# EAGLE design ERC128128FS_Breakout (EAGLE 7.4.0)
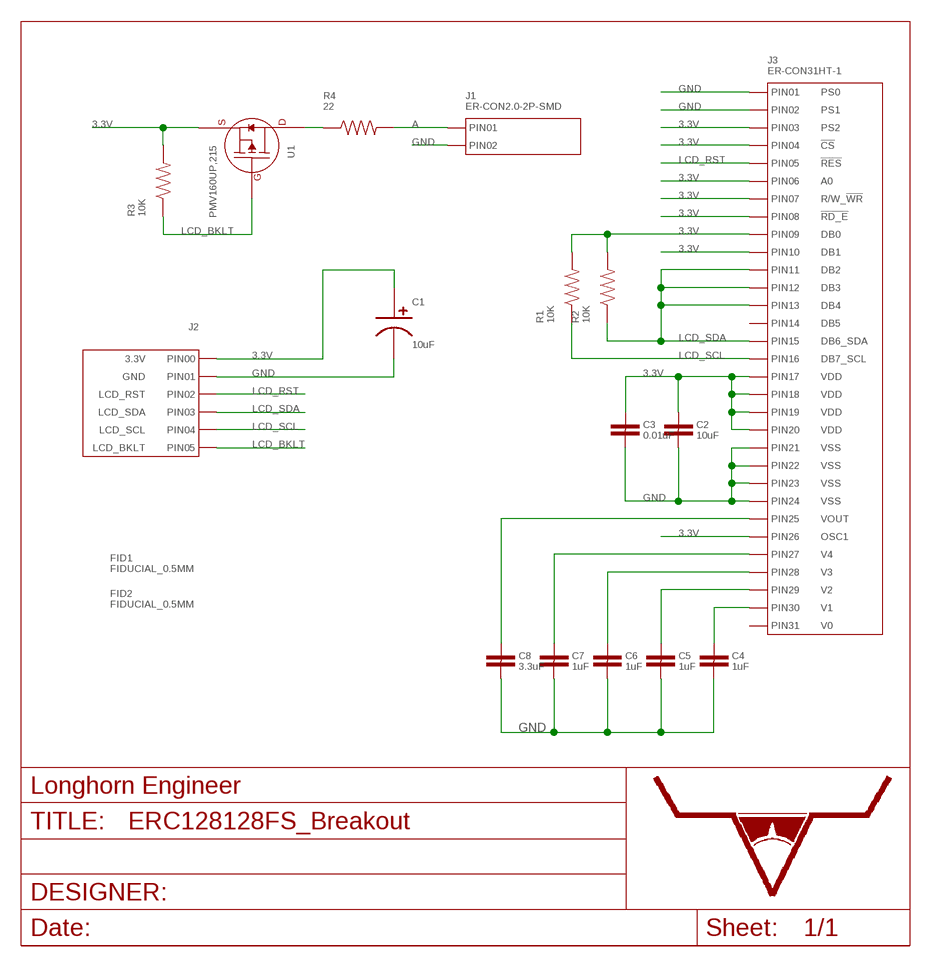
[diagram p0: schematic, sheet 1]

## Parts
C1  10uF  CAPACITOR_P_4MM  [CP4MM]
C2  10uF  CAPACITOR_NON_POLAR_1206  [1206]
C3  0.01uF  CAPACITOR_NON_POLAR_0603  [0603]
C4  1uF  CAPACITOR_NON_POLAR_0603  [0603]
C5  1uF  CAPACITOR_NON_POLAR_0603  [0603]
C6  1uF  CAPACITOR_NON_POLAR_0603  [0603]
C7  1uF  CAPACITOR_NON_POLAR_0603  [0603]
C8  3.3uF  CAPACITOR_NON_POLAR_0603  [0603]
FID1  FIDUCIAL_0.5MM  [FIDUCIAL_0.5MM]
FID2  FIDUCIAL_0.5MM  [FIDUCIAL_0.5MM]
J1  ER-CON2.0-2P-SMD  CON_01X02_ER-CON2.0-2P-SMD  [ER-CON2.0-2P-SMD]
J2  HEADER_01X06_PTH_2.54MM  [PTH_2.54MM_01X06]
J3  ER-CON31HT-1  CON_01X31_ER-CON31HT-1  [ER-CON31HT-1]
R1  10K  RESISTOR_0603  [0603]
R2  10K  RESISTOR_0603  [0603]
R3  10K  RESISTOR_0603  [0603]
R4  22  RESISTOR_0603  [0603]
U1  PMV160UP,215  MOSFET_P-CHANNEL_SINGLE_SOT-23  [SOT-23-3]
U$1  LHE_FRAME  [LHE_FRAME]

## Nets
3.3V: C1.P$1 C2.1 C3.1 J2.P$1(PIN0) J3.P$3(PIN3) J3.P$4(PIN4) J3.P$6(PIN6) J3.P$7(PIN7) J3.P$8(PIN8) J3.P$9(PIN9) J3.P$10(PIN10) J3.P$17(PIN17) J3.P$18(PIN18) J3.P$19(PIN19) J3.P$20(PIN20) J3.P$26(PIN26) R1.2 R2.2 R3.2 U1.2(SOURCE)
A: J1.P$1(PIN1) R4.2
GND: C1.P$2 C2.2 C3.2 C4.2 C5.2 C6.2 C7.2 C8.2 J1.P$2(PIN2) J2.P$2(PIN1) J3.P$1(PIN1) J3.P$2(PIN2) J3.P$21(PIN21) J3.P$22(PIN22) J3.P$23(PIN23) J3.P$24(PIN24)
LCD_BKLT: J2.P$6(PIN5) R3.1 U1.1(GATE)
LCD_RST: J2.P$3(PIN2) J3.P$5(PIN5)
LCD_SCL: J2.P$5(PIN4) J3.P$16(PIN16) R1.1
LCD_SDA: J2.P$4(PIN3) J3.P$11(PIN11) J3.P$12(PIN12) J3.P$13(PIN13) J3.P$15(PIN15) R2.1
N$7: R4.1 U1.3(DRAIN)
N$9: C8.1 J3.P$25(PIN25)
N$10: C7.1 J3.P$27(PIN27)
N$11: C6.1 J3.P$28(PIN28)
N$12: C5.1 J3.P$29(PIN29)
N$13: C4.1 J3.P$30(PIN30)
Unconnected: J3.P$14(PIN14) J3.P$31(PIN31)

## Library data of the parts
C1 = MF_Passives:CAPACITOR_P: Library: MF_Passives Description: Device for Polarized Capacitors. Manufacture part number (MFG#), Voltage Rating, and Tolerance can be added via Attributes.; MFG#: N/A; TOLERANCE: N/A; VOLTAGE: N/A
C2-C8 = PP_Passives:CAPACITOR_NON_POLAR: Capacitor Non Polarized
FID1 FID2 = MF_Aesthetics:FIDUCIAL: Library: MF_Aesthetics Description: Fiducial marking for PCB alignment inside PNP and other machines.
J1 = PP_Connectors:CON_01X02
J2 = MF_Connectors:HEADER_01X06: Library: MF_Connectors Description: Header Connector with 6 Positions and 01 Rows. Use the LABEL Attribute to label the pin on the schematic and PCB. You can remove the attributes on the PCB by using the SMASH function on the part and then deleting the text.; LABEL00: 3.3V; LABEL01: GND; LABEL02: LCD_RST; LABEL03: LCD_SDA; LABEL04: LCD_SCL; LABEL05: LCD_BKLT
J3 = PP_Connectors:CON_01X31; LABEL01: PS0; LABEL02: PS1; LABEL03: PS2; LABEL04: !CS; LABEL05: !RES; LABEL06: A0; LABEL07: R/W_!WR; LABEL08: !RD_E; LABEL09: DB0; LABEL10: DB1; LABEL11: DB2; LABEL12: DB3; LABEL13: DB4; LABEL14: DB5; LABEL15: DB6_SDA; LABEL16: DB7_SCL; LABEL17: VDD; LABEL18: VDD; LABEL19: VDD; LABEL20: VDD; LABEL21: VSS; LABEL22: VSS; LABEL23: VSS; LABEL24: VSS; LABEL25: VOUT; LABEL26: OSC1; LABEL27: V4; LABEL28: V3; LABEL29: V2; LABEL30: V1; LABEL31: V0
R1-R4 = PP_Passives:RESISTOR: Resistors
U1 = PP_DiscreteSemi:MOSFET_P-CHANNEL_SINGLE
U$1 = PP_Aesthetics:LHE_FRAME; DNAME: Parker Dillmann; REVNUM: REV: 2

## Board
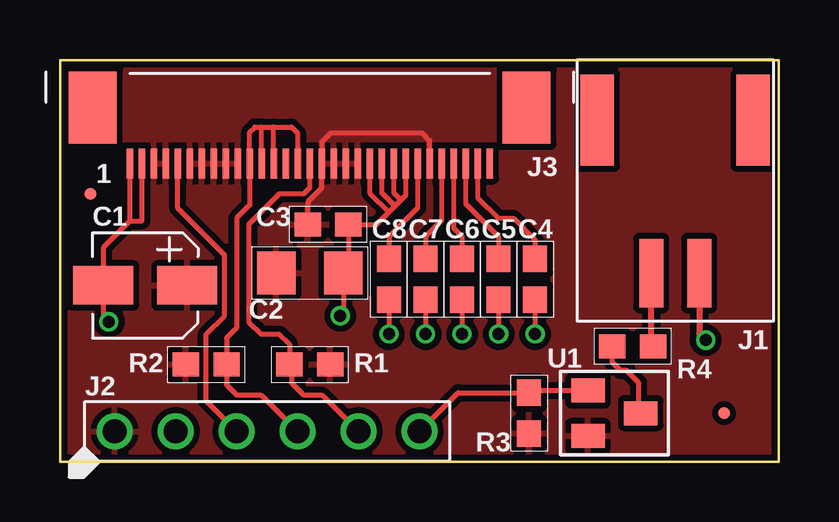
[diagram p1: board, top side]
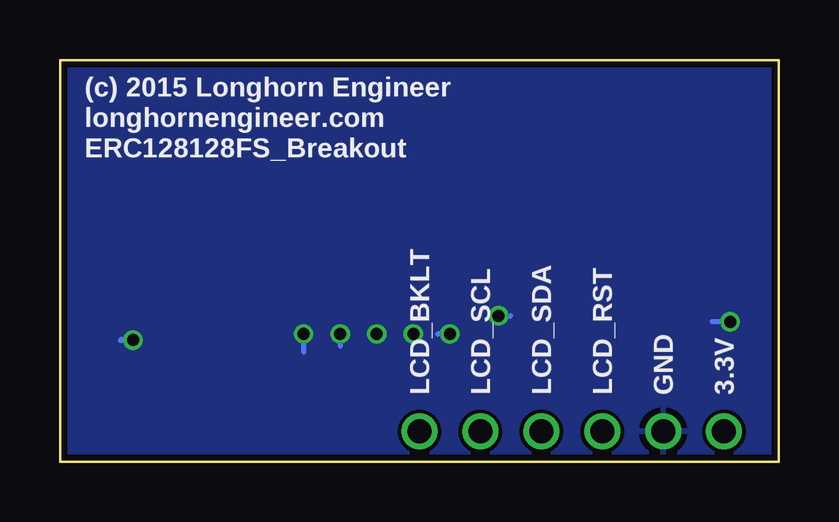
[diagram p2: board, bottom side, seen from below]

Size 29.97 x 16.76 mm. Coordinates in mm from the lower left corner, seen from the top.
Outline: 0,0 0,16.76 29.97,16.76 29.97,0 0,0
Copper layers (1*16): Top 0.035mm / dielectric 0.2mm / Bottom 0.035mm
Design rules "MF_2_Layer": minimum track width 6mil, minimum drill 12mil, track to track 6mil, track to pad 6mil, pad to pad 6mil, via to via 6mil, smd to smd 0mil, copper to edge 10mil, drill to drill 10mil, minimum pad ring 6mil, minimum via ring 6mil, stop-mask expansion 2mil, vias tented up to drill 25mil, thermal gap 10mil

### Footprints (pad centres in the part's own frame; a part is rotated, then mirrored left to right if it is on the bottom)
CP4MM = smd 1.6 x 2.5: P$1 0,-1.75; P$2 0,1.75
1206 = smd 1.6 x 1.8: 1 -1.4,0; 2 1.4,0
0603 = smd 1.1 x 1: 1 -0.85,0; 2 0.85,0
FIDUCIAL_0.5MM = smd 0.5 x 0.5: FID 0,0
ER-CON2.0-2P-SMD = smd 1 x 2.85: P$1 -1,0; P$2 1,0 | smd 1.4 x 3.8: P$3 3.25,6.375; P$4 -3.25,6.375
PTH_2.54MM_01X06 = drill 1: P$1 -6.35,0; P$2 -3.81,0; P$3 -1.27,0; P$4 1.27,0; P$5 3.81,0; P$6 6.35,0
ER-CON31HT-1 = smd 0.28 x 1.25: P$1 -7.5,0; P$2 -7,0; P$3 -6.5,0; P$4 -6,0; P$5 -5.5,0; P$6 -5,0; P$7 -4.5,0; P$8 -4,0; P$9 -3.5,0; P$10 -3,0; P$11 -2.5,0; P$12 -2,0; P$13 -1.5,0; P$14 -1,0; P$15 -0.5,0; P$16 0,0; P$17 0.5,0; P$18 1,0; P$19 1.5,0; P$20 2,0; P$21 2.5,0; P$22 3,0; P$23 3.5,0; P$24 4,0; P$25 4.5,0; P$26 5,0; P$27 5.5,0; P$28 6,0; P$29 6.5,0; P$30 7,0; P$31 7.5,0 | smd 2 x 3: P$32 -9.04,2.325; P$33 9.04,2.325
SOT-23-3 = smd 1 x 1.4: 1 -0.95,-1.1; 2 0.95,-1.1; 3 0,1.1

### Placement (x,y rotation side)
C1  3.56,7.37 90 top
C2  10.41,7.87 0 top
C3  11.18,9.91 0 top
C4  19.81,7.62 270 top
C5  18.29,7.62 270 top
C6  16.76,7.62 270 top
C7  15.24,7.62 270 top
C8  13.72,7.62 270 top
FID1  27.69,2.03 0 top
FID2  1.27,11.18 0 top
J1  25.65,7.87 0 top
J2  8.64,1.27 0 top
J3  10.41,12.45 0 top
R1  10.41,4.06 0 top
R2  6.1,4.06 180 top
R3  19.56,2.03 270 top
R4  23.88,4.83 0 top
U1  23.11,2.03 270 top
U$1  28.96,10.16 0 bottom

### Tracks (layer width: path | path; a pad name or v marks a point on that pad's centre or on a via)
3.3V
  Top 0.203: J3.P$26 15.41,13.41 15.11,13.72 11.28,13.72 10.92,13.36 J3.P$17 10.91,11.42 10.33,10.83 C3.1
  pour Top (isolate 0.254): 0,16.76 0,0 29.97,0 29.97,16.76
A
  Top 0.254: R4.2 24.65,4.9 J1.P$1
GND  (via drill 0.5)
  Top 0.203: J3.P$2 3.41,10.05 2.91,10.05 | J3.P$1 2.91,10.05 | 2.91,10.05 1.81,8.94 C1.P$2 1.81,6.07 v2.03,5.84 | J3.P$24 14.41,11.11 14.22,10.92 | 14.22,10.92 13.97,10.67 | 13.97,10.67 13.72,10.41 | J3.P$23 13.91,11.23 14.22,10.92 | J3.P$22 13.41,11.22 13.97,10.67 | J3.P$21 12.91,11.22 13.72,10.41 | 13.72,10.41 13.21,9.91 C3.2 12.03,8.09 C2.2 11.81,6.23 v11.68,6.1 | C8.2 v13.72,5.33 | C7.2 v15.24,5.33 | C6.2 v16.76,5.33 | C5.2 v18.29,5.33 | C4.2 v19.81,5.33
  Top 0.254: J1.P$2 26.65,5.35 v26.92,5.08
  Bottom 0.203: v2.03,5.84 2.79,5.84 | v11.68,6.1 11.18,6.1 | v13.72,5.33 14.22,5.33 | v15.24,5.33 15.24,5.08 | v16.76,5.33 16.76,5.08 | v18.29,5.33 18.29,4.83 | v19.81,5.33 19.81,4.57
  Bottom 0.254: v26.92,5.08 27.43,5.08
  pour Bottom: 0,16.51 0,0 29.72,0 29.72,16.51
LCD_BKLT
  Top 0.203: J2.P$6 16.6,2.88 R3.1 | 19.66,2.98 U1.1
  Top 0.254: R3.1 19.66,2.98
LCD_RST
  Top 0.203: J2.P$3 6.1,2.54 6.1,5.33 6.86,6.1 6.86,8.64 4.91,10.58 J3.P$5
LCD_SCL
  Top 0.203: J3.P$16 10.41,11.43 10.16,11.18 9.14,11.18 7.87,9.91 7.87,5.84 8.38,5.33 9.14,5.33 9.56,4.91 R1.1 9.65,3.98 9.65,3.3 10.16,2.79 10.92,2.79 J2.P$5
LCD_SDA
  Top 0.203: J2.P$4 8.38,2.79 7.37,2.79 6.95,3.21 R2.1 6.95,5.17 7.37,5.59 7.37,10.16 7.91,10.71 J3.P$11 7.91,13.76 8.13,13.97 8.38,13.97 | 8.38,13.97 8.89,13.97 | 8.89,13.97 9.65,13.97 9.91,13.72 J3.P$15 | J3.P$12 8.41,13.94 8.38,13.97 | J3.P$13 8.91,13.95 8.89,13.97
N$7
  Top 0.203: 24.13,2.12 24.13,3.3 23.62,3.81 23.37,3.81 23.03,4.15 R4.1
  Top 0.254: U1.3 24.13,2.12
N$9
  Top 0.203: J3.P$25 14.91,10.6 13.72,9.4 C8.1
N$10
  Top 0.203: J3.P$27 15.91,10.07 15.24,9.4 C7.1
N$11
  Top 0.203: J3.P$28 16.41,9.75 16.76,9.4 C6.1
N$12
  Top 0.203: J3.P$29 16.91,10.77 18.29,9.4 C5.1
N$13
  Top 0.203: J3.P$30 17.41,11.03 18.29,10.16 18.9,10.16 19.81,9.24 C4.1